# Altium schematic sheet BAT_INDICATOR.SchDoc
size A4
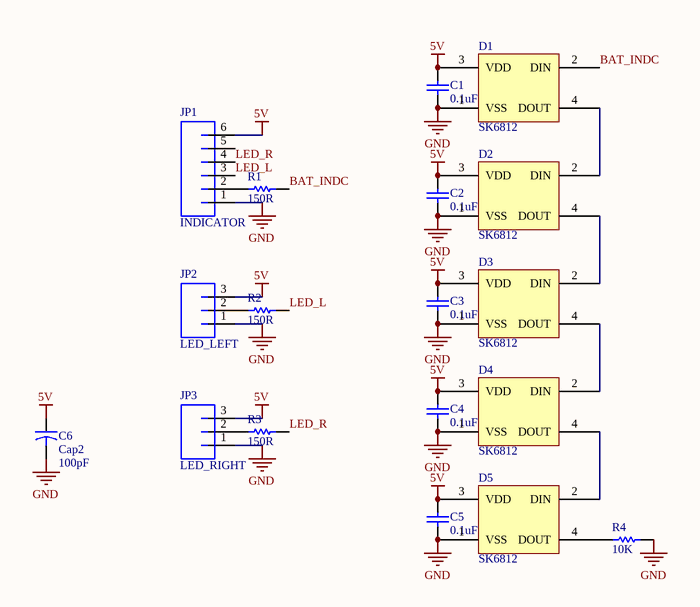
[diagram p0: BAT_INDICATOR.SchDoc]

## Parts
C1  value 0.1uF  [C0603[1608X92]]  (hidden comment: 0.1uF 16V 0603)
C2  value 0.1uF  [C0603[1608X92]]  (hidden comment: 0.1uF 16V 0603)
C3  value 0.1uF  [C0603[1608X92]]  (hidden comment: 0.1uF 16V 0603)
C4  value 0.1uF  [C0603[1608X92]]  (hidden comment: 0.1uF 16V 0603)
C5  value 0.1uF  [C0603[1608X92]]  (hidden comment: 0.1uF 16V 0603)
C6  Cap2  value 100pF  [CAPR5-4X5]
D1  SK6812  [SK6812]
D2  SK6812  [SK6812]
D3  SK6812  [SK6812]
D4  SK6812  [SK6812]
D5  SK6812  [SK6812]
JP1  INDICATOR  [JST-PH-6-PTH-VERT]
JP2  LED_LEFT  [JST-PH-3-PTH-VERT]
JP3  LED_RIGHT  [JST-PH-3-PTH-VERT]
R1  value 150R  [R0603[1608]]  (hidden comment: 150R 1% 0603)
R2  value 150R  [R0603[1608]]  (hidden comment: 150R 1% 0603)
R3  value 150R  [R0603[1608]]  (hidden comment: 150R 1% 0603)
R4  value 10K  [R0603[1608]]  (hidden comment: 10K 1% 0603)

## Nets
5V: C1.2 C2.2 C3.2 C4.2 C5.2 C6.1 D1.3(VDD) D2.3(VDD) D3.3(VDD) D4.3(VDD) D5.3(VDD) JP1.6 JP2.3 JP3.3
GND: C1.1 C2.1 C3.1 C4.1 C5.1 C6.2 D1.1(VSS) D2.1(VSS) D3.1(VSS) D4.1(VSS) D5.1(VSS) JP1.1 JP2.1 JP3.1 R4.1
BAT_INDC: D1.2(DIN) R1.2
LED_L: JP1.3 R2.2
LED_R: JP1.4 R3.2
NetD1_4: D1.4(DOUT) D2.2(DIN)
NetD2_4: D2.4(DOUT) D3.2(DIN)
NetD3_4: D3.4(DOUT) D4.2(DIN)
NetD4_4: D4.4(DOUT) D5.2(DIN)
NetD5_4: D5.4(DOUT) R4.2
NetJP1_2: JP1.2 R1.1
NetJP2_2: JP2.2 R2.1
NetJP3_2: JP3.2 R3.1

Not connected (* = marked no-connect by the designer): JP1 5

## Library data of the parts
C1-C5 = CAP_0.1uF_16V_0603_10%: 0.1uF 16V 10% 0603 (1608 Metric); PartNumber: GCM188R71C104KA37D; Manufacturer: Murata; TemperatureCoefficient: X7R; Mounting Technology: Surface Mount; PackageReference: 0603; PackageDescription: 0603 (1608 Metric); Voltage: 16V; Tolerance: 10%
C6 = Cap2: Capacitor; Published: 23-Sep-2002; PackageReference: CAPR5-4X5; Publisher: Altium Limited; PackageDescription: Capacitor; 2 Leads
D1-D5 = SK6812: smart control circuit and a light emitting circuit in one of the controlled LED source
JP1 = JST_PH_6_VERT: PartNumber: B6B-PH-K-S(LF)(SN); Manufacturer: JST Sales America Inc.; PackageReference: JST-PH; Mounting Technology: Through Hole
JP2 JP3 = JST_PH_3_VERT: Manufacturer: JST Sales America Inc.; PartNumber: B3B-PH-K-S(LF)(SN); Mounting Technology: Through Hole; PackageReference: JST-PH
R1-R3 = RES_150R_0603_1%: 150R 0.25W 1% 0603 (1005 Metric); Manufacturer: Vishay / Dale; PartNumber: CRCW0603150RFKEAHP; Tolerance: 1%; Power: 0.25W; Mounting Technology: Surface Mount; PackageReference: 0603; PackageDescription: 0603 (1608 Metric); ComponentLink1Description: Datasheet; ComponentLink1URL: http://www.vishay.com/docs/20043/crcwhpe3.pdf
R4 = RES_10K_0603_1%: 10K 0.25W 1% 0603 (1005 Metric); Manufacturer: Vishay / Dale; PartNumber: CRCW060310K0FKEAHP; Tolerance: 1%; Power: 0.25W; Mounting Technology: Surface Mount; PackageReference: 0603; PackageDescription: 0603 (1608 Metric); ComponentLink1Description: Datasheet; ComponentLink1URL: http://www.vishay.com/docs/20065/rcse3.pdf